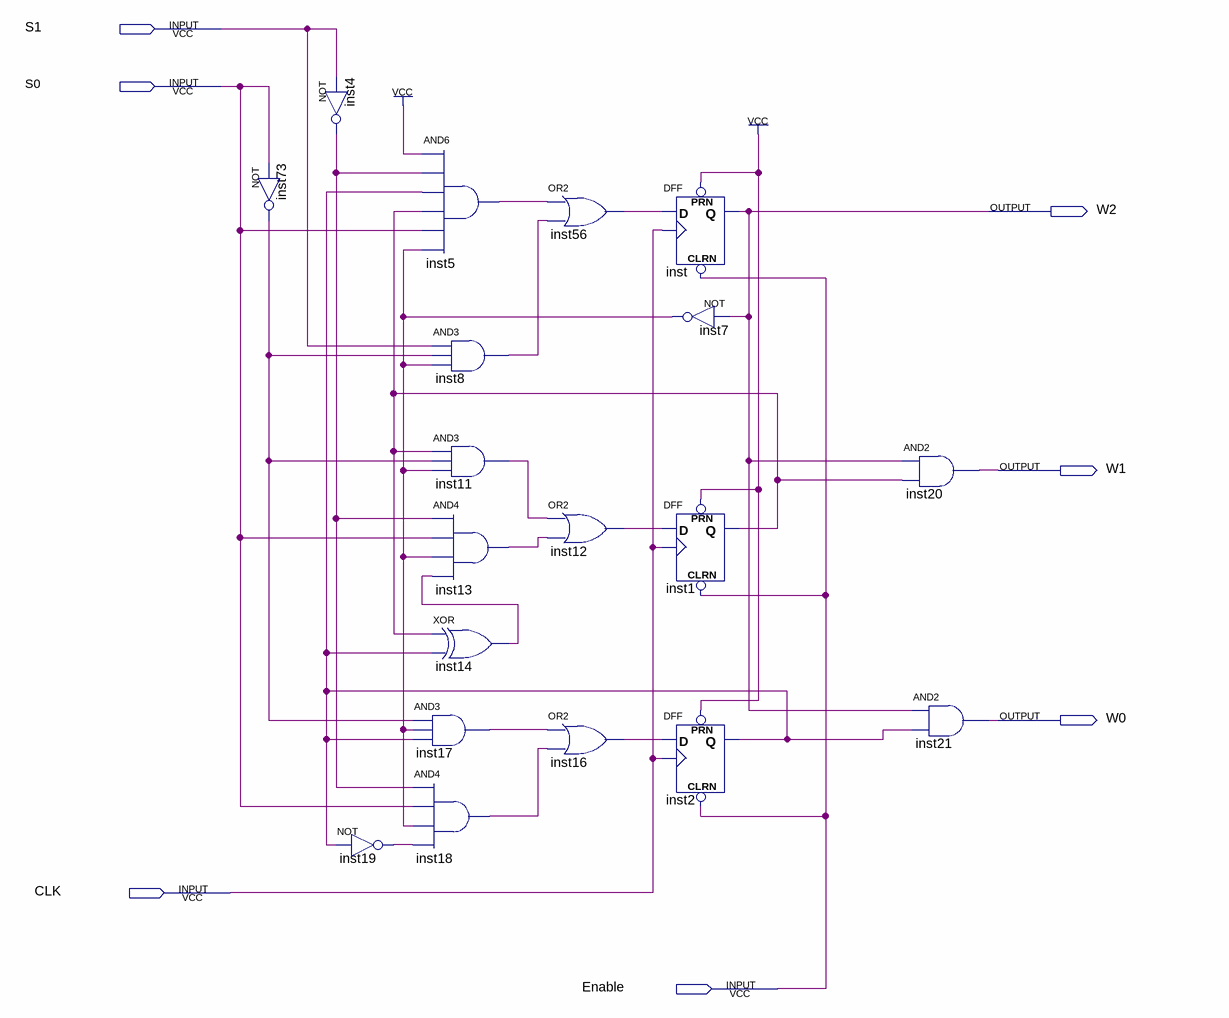
[diagram p0: schematic sheet]
// Quartus schematic dollarFSM.bdf as structural Verilog: 19 symbols, 7 pins
module dollarFSM (
  input  S1,
  input  S0,
  input  CLK,
  input  Enable,
  output W2,
  output W1,
  output W0
);

  wire inst1_q, inst2_q, inst4_out, inst5_out, inst7_out, inst8_out, inst11_out, inst12_out, inst13_out,
       inst14_out, inst16_out, inst17_out, inst18_out, inst19_out, inst56_out, inst73_out;

  not inst73 (inst73_out, S0);
  not inst4 (inst4_out, S1);
  not inst19 (inst19_out, inst2_q);
  and inst5 (inst5_out, 1'b1, inst4_out, inst2_q, inst1_q, S0, inst7_out);
  and inst8 (inst8_out, S1, inst73_out, inst7_out);
  and inst11 (inst11_out, inst1_q, inst73_out, inst7_out);
  and inst13 (inst13_out, inst4_out, S0, inst7_out, inst14_out);
  xor inst14 (inst14_out, inst1_q, inst2_q);
  and inst17 (inst17_out, inst73_out, inst7_out, inst2_q);
  and inst18 (inst18_out, inst4_out, S0, inst7_out, inst19_out);
  or inst56 (inst56_out, inst5_out, inst8_out);
  or inst12 (inst12_out, inst11_out, inst13_out);
  or inst16 (inst16_out, inst17_out, inst18_out);
  DFF inst (.CLRN(Enable), .CLK(CLK), .D(inst56_out), .PRN(1'b1), .Q(W2));
  DFF inst1 (.CLRN(Enable), .CLK(CLK), .D(inst12_out), .PRN(1'b1), .Q(inst1_q));
  DFF inst2 (.CLRN(Enable), .CLK(CLK), .D(inst16_out), .PRN(1'b1), .Q(inst2_q));
  not inst7 (inst7_out, W2);
  and inst20 (W1, W2, inst1_q);
  and inst21 (W0, W2, inst2_q);
endmodule
